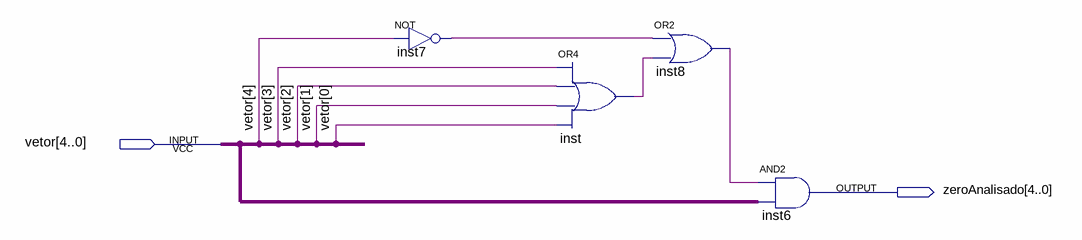
[diagram p0: schematic sheet]
// Quartus schematic AnalisadorDoZeroPara4BitsESinal.bdf as structural Verilog: 4 symbols, 2 pins
module AnalisadorDoZeroPara4BitsESinal (
  input  [4:0] vetor,
  output [4:0] zeroAnalisado
);

  wire inst7_out, inst8_out, inst_out;

  not inst7 (inst7_out, vetor[4]);
  or inst (inst_out, vetor[3], vetor[2], vetor[1], vetor[0]);
  or inst8 (inst8_out, inst7_out, inst_out);
  assign zeroAnalisado = {5{inst8_out}} & vetor;  // AND2 inst6, 5 bits wide
endmodule
